# Altium project SFControl.PrjPcb
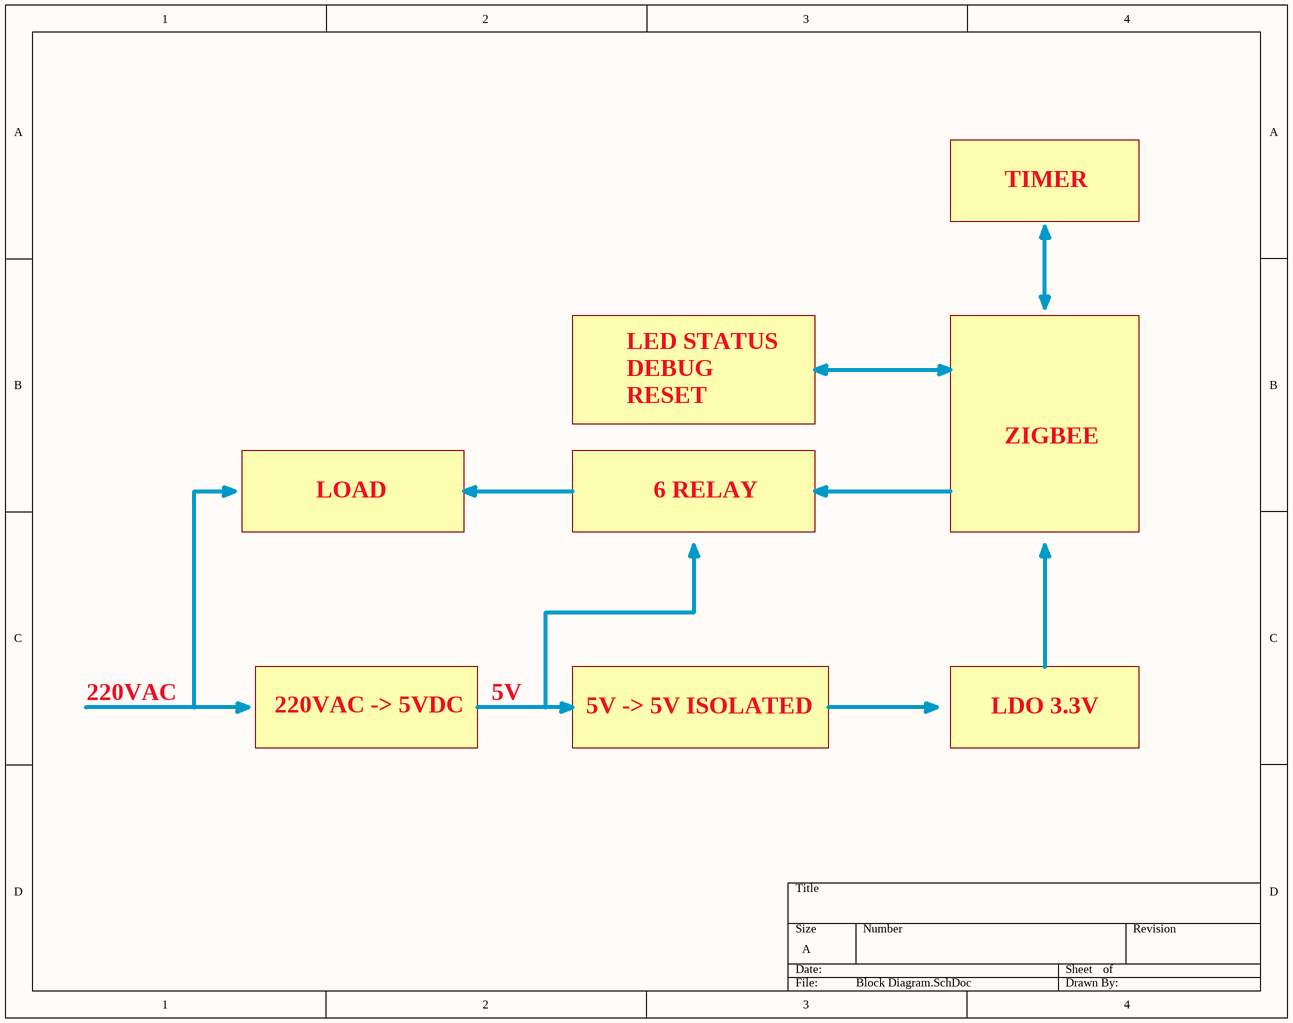
[diagram p0: Block Diagram.SchDoc]
4 sheets, 79 parts. Net scope: flat (ports and power ports of the same name join across sheets).
Board file: SFControl.PcbDoc
Sheets:
  Block Diagram.SchDoc
  Power.SchDoc
  Connectivity.SchDoc
  Control.SchDoc

## Sheet Block Diagram.SchDoc
size A; DocumentNumber: 1; SheetNumber: 1; SheetTotal: 4

### Notes on the sheet
- TIMER
- LED STATUS
- DEBUG
- RESET
- LOAD
- 6 RELAY
- ZIGBEE
- 220VAC
- 5V
- 220VAC -> 5VDC
- 5V -> 5V ISOLATED
- LDO 3.3V

## Sheet Power.SchDoc
size A; DocumentNumber: 2; SheetNumber: 2; SheetTotal: 4
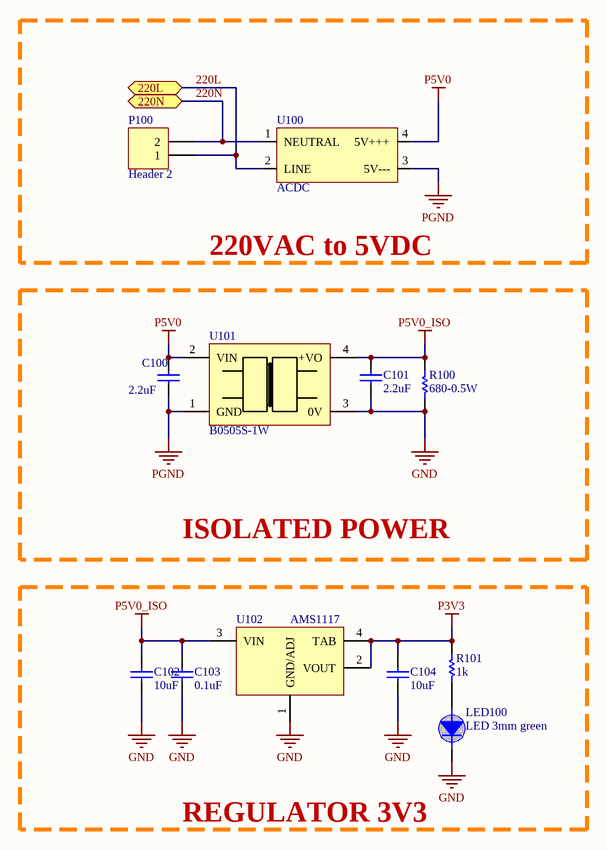
[diagram p1: Power.SchDoc]

### Parts
C100  2.2uF  [0805 cap]
C101  2.2uF  [0805 cap]
C102  10uF  [0805 cap]
C103  0.1uF  [0805 cap]
C104  10uF  [0805 cap]
LED100  LED 3mm green  [LED 3mm green]
P100  Header 2  [HED2T]
R100  680-0.5W  [0805 Resistor]
R101  1k  [0805 Resistor]
U100  ACDC  [ACDC]
U101  B0505S-1W  [B0505S-1W]
U102  AMS1117  [SOT223-3]

### Blocks framed on the sheet
220VAC to 5VDC: P100 U100
ISOLATED POWER: C100 C101 R100 U101
REGULATOR 3V3: C102-C104 LED100 R101 U102

### Ports
220L, 220N

### Nets
GND: C101.1 C102.1 C103.1 C104.1 LED100.2(Katot) R100.1 U101.3(0V) U102.1(GND/ADJ)
P3V3: C104.2 R101.2 U102.2(VOUT) U102.4(TAB)
P5V0: C100.2 U100.4(5V+++) U101.2(VIN)
P5V0_ISO: C101.2 C102.2 C103.2 R100.2 U101.4(+VO) U102.3(VIN)
PGND: C100.1 U100.3(5V---) U101.1(GND)
220L: P100.1 U100.2(LINE) ; port 220L
220N: P100.2 U100.1(NEUTRAL) ; port 220N
NetLED100_1: LED100.1(anot) R101.1

### Library data of the parts
C100-C104 = cap SMD
P100 = Header 2: Header, 2-Pin; LatestRevisionDate: 17-Jul-2002; LatestRevisionNote: Re-released for DXP Platform.; Publisher: Altium Limited
R100 R101 = Resistor

## Sheet Connectivity.SchDoc
size A; DocumentNumber: 3; SheetNumber: 3; SheetTotal: 4
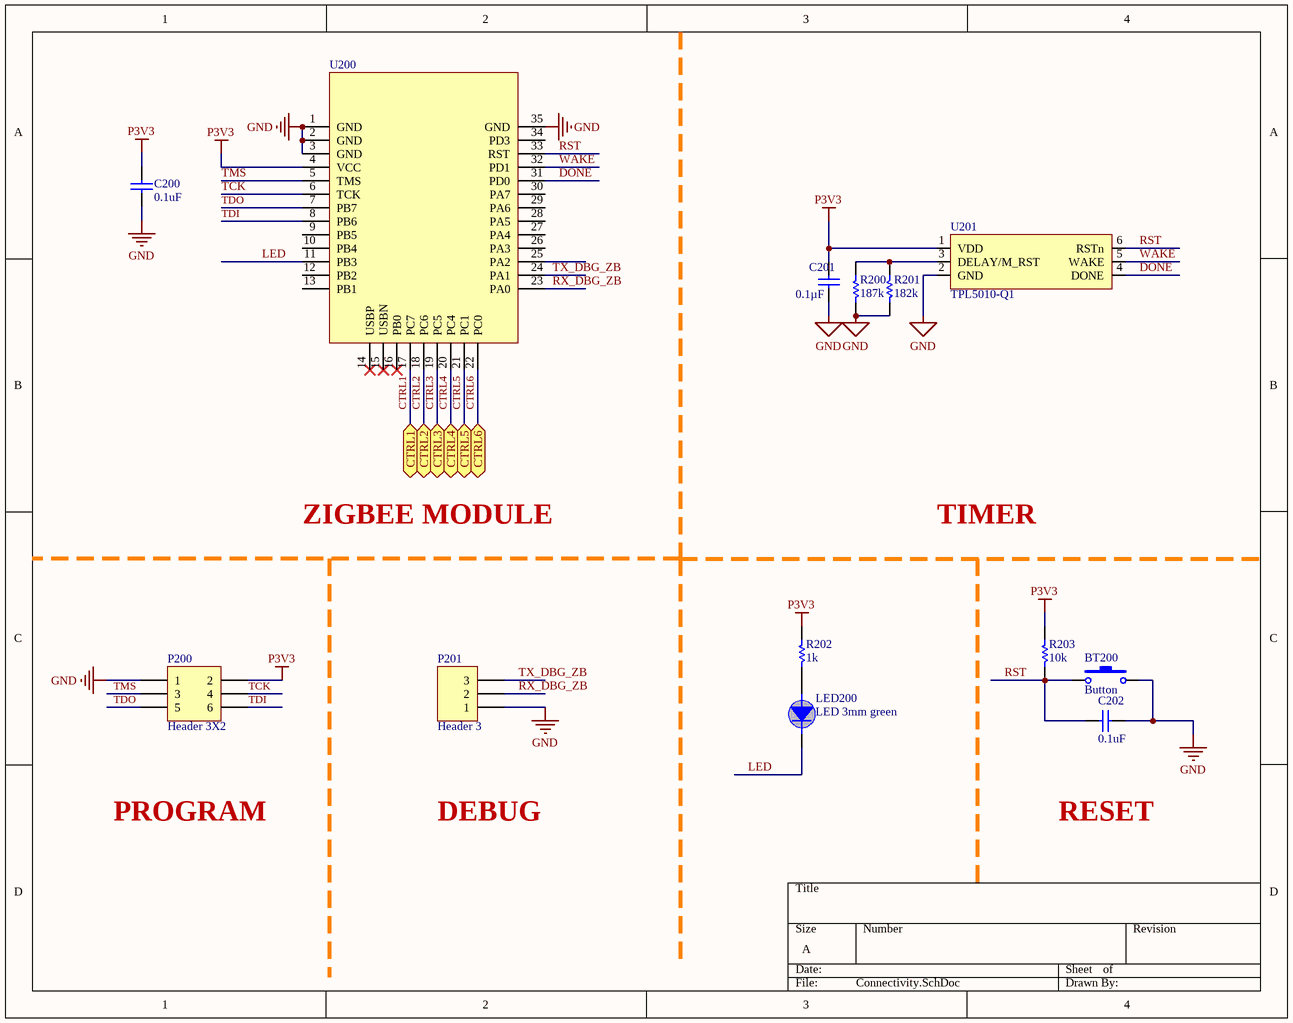
[diagram p2: Connectivity.SchDoc]

### Parts
BT200  Button  [SWSMD]
C200  0.1uF  [0805 cap]
C201  0.1µF  [0805 cap]
C202  0.1uF  [0805 cap]
LED200  LED 3mm green  [LED 3mm green]
P200  Header 3X2  [HDR2X3]
P201  Header 3  [HDR1X3]
R200  187k  [0805 Resistor]
R201  182k  [0805 Resistor]
R202  1k  [0805 Resistor]
R203  10k  [0805 Resistor]
U200  (no value)  [VZIGMOD2]
U201  TPL5010-Q1  [SOT23-6]

### Ports
CTRL1, CTRL2, CTRL3, CTRL4, CTRL5, CTRL6

### Nets
GND: BT200.2 C200.1 C201.1 C202.1 P200.1 P201.1 R200.1 R201.1 U200.1(GND) U200.2(GND) U200.3(GND) U200.35(GND) U201.2(GND)
P3V3: C200.2 C201.2 P200.2 R202.2 R203.2 U200.4(VCC) U201.1(VDD)
CTRL1: U200.17(PC7) ; port CTRL1
CTRL2: U200.18(PC6) ; port CTRL2
CTRL3: U200.19(PC5) ; port CTRL3
CTRL4: U200.20(PC4) ; port CTRL4
CTRL5: U200.21(PC1) ; port CTRL5
CTRL6: U200.22(PC0) ; port CTRL6
DONE: U200.31(PD0) U201.4(DONE)
LED: LED200.2(Katot) U200.11(PB3)
RST: BT200.1 C202.2 R203.1 U200.33(RST) U201.6(RSTn)
RX_DBG_ZB: P201.2 U200.23(PA0)
TCK: P200.4 U200.6(TCK)
TDI: P200.6 U200.8(PB6)
TDO: P200.5 U200.7(PB7)
TMS: P200.3 U200.5(TMS)
TX_DBG_ZB: P201.3 U200.24(PA1)
WAKE: U200.32(PD1) U201.5(WAKE)
NetLED200_1: LED200.1(anot) R202.1
NetR200_2: R200.2 R201.2 U201.3(DELAY/M_RST)

Not connected (* = marked no-connect by the designer): U200 9(PB5) 10(PB4) 12(PB2) 13(PB1) 14(USBP)* 15(USBN)* 16(PB0)* 25(PA2) 26(PA3) 27(PA4) 28(PA5) 29(PA6) 30(PA7) 34(PD3)

### Notes on the sheet
- ZIGBEE MODULE
- TIMER
- PROGRAM
- DEBUG
- RESET

### Library data of the parts
C200 = CAP0.1u0402: CAP CER 0.1UF 16V X7R 0402; Manufacturer: Samsung Electro-Mechanics; Manufacturer Part Number: CL05B104KO5NNNC; Tolerance: ±10%; Notification: Current market demand for these product types have resulted in fluctuating and extending lead times. Lead times may differ.; Module: Connectivity; Supplier 1: Digi-Key; Supplier Part Number 1: 1276-1001-6-ND; RoHS: RoHS Compliant; Category: Capacitors; Stock 1: 100000; Pricing 1: 1=0.1, 10=0.03, 100=0.0134, 500=0.00958, 1000=0.00753, 2500=0.00684, 5000=0.0063 (USD); Packaging: Digi-Reel®; Part Status: Active; Voltage - Rated: 16V; Temperature Coefficient: X7R; Operating Temperature: -55°C ~ 125°C; Features: -; Ratings: -; Applications: General Purpose; Mounting Type: Surface Mount, MLCC; Package / Case: 0402 (1005 Metric); Size / Dimension: 0.039" L x 0.020" W (1.00mm x 0.50mm); Height - Seated (Max): -; Thickness (Max): 0.022" (0.55mm); Lead Spacing: -; Lead Style: -; ComponentLink1URL: http://www.samsungsem.com/kr/support/product-search/mlcc/CL05B104KO5NNNC.jsp; ComponentLink1Description: http://www.samsungsem.com/kr/support/product-search/mlcc/CL05B104KO5NNNC.jsp
C201 = CAP0.1u0402: CAP CER 0.1UF 10V X7R 0402; Manufacturer: Taiyo Yuden; Manufacturer Part Number: LMK105B7104KVHF; Tolerance: ±10%; Supplier 1: Digi-Key; RoHS: RoHS Compliant; Category: Capacitors; Stock 1: 23930; Pricing 1: 1=0.1, 10=0.05, 100=0.0223, 500=0.01594, 1000=0.01252, 2500=0.01138, 5000=0.01047 (USD); Packaging: Cut Tape (CT); Part Status: Active; Capacitance: 0.1µF; Voltage - Rated: 10V; Temperature Coefficient: X7R; Operating Temperature: -55°C ~ 125°C; Features: -; Ratings: AEC-Q200; Applications: Automotive; Mounting Type: Surface Mount, MLCC; Package / Case: 0402 (1005 Metric); Size / Dimension: 0.039" L x 0.020" W (1.00mm x 0.50mm); Height - Seated (Max): -; Thickness (Max): 0.022" (0.55mm); Lead Spacing: -; Lead Style: -; ComponentLink1URL: http://www.yuden.co.jp/productdata/catalog/en/mlcc_all_hq_e.pdf; ComponentLink1Description: http://www.yuden.co.jp/productdata/catalog/en/mlcc_all_hq_e.pdf; Supplier Part Number 1: 587-3769-1-ND
C202 = cap SMD
P200 = Header 3X2: Header, 3-Pin, Dual row; LatestRevisionDate: 17-Jul-2002; LatestRevisionNote: Re-released for DXP Platform.; Publisher: Altium Limited
P201 = Header 3: Header, 3-Pin; LatestRevisionDate: 17-Jul-2002; LatestRevisionNote: Re-released for DXP Platform.; Publisher: Altium Limited
R200 = Resistor: RES SMD 187K OHM 1% 1/10W 0603; Manufacturer: Panasonic Electronic Components; Manufacturer Part Number: ERJ-3EKF1873V; Power (Watts): 0.1W, 1/10W; Temperature Coefficient: ±100ppm/°C; Supplier 1: Digi-Key; Supplier Part Number 1: P187KHCT-ND; RoHS: RoHS Compliant; Category: Resistors; Stock 1: 17711; Pricing 1: 1=0.1, 10=0.021, 100=0.0087, 1000=0.00389, 2500=0.00338 (USD); Packaging: Cut Tape (CT); Part Status: Active; Resistance (Ohms): 187k; Tolerance: ±1%; Composition: Thick Film; Features: Automotive AEC-Q200; Operating Temperature: -55°C ~ 155°C; Package / Case: 0603 (1608 Metric); Supplier Device Package: 0603; Size / Dimension: 0.063" L x 0.031" W (1.60mm x 0.80mm); Height - Seated (Max): 0.022" (0.55mm); Failure Rate: -; ComponentLink1URL: https://industrial.panasonic.com/cdbs/www-data/pdf/RDA0000/AOA0000C298.pdf; ComponentLink1Description: https://industrial.panasonic.com/cdbs/www-data/pdf/RDA0000/AOA0000C298.pdf
R201 = Resistor: RES SMD 182K OHM 1% 1/10W 0603; Manufacturer: Panasonic Electronic Components; Manufacturer Part Number: ERJ-3EKF1823V; Power (Watts): 0.1W, 1/10W; Temperature Coefficient: ±100ppm/°C; Supplier 1: Digi-Key; Supplier Part Number 1: P182KHCT-ND; RoHS: RoHS Compliant; Category: Resistors; Stock 1: 140068; Pricing 1: 1=0.1, 10=0.021, 100=0.0087, 1000=0.00389, 2500=0.00338 (USD); Packaging: Cut Tape (CT); Part Status: Active; Resistance (Ohms): 182k; Tolerance: ±1%; Composition: Thick Film; Features: Automotive AEC-Q200; Operating Temperature: -55°C ~ 155°C; Package / Case: 0603 (1608 Metric); Supplier Device Package: 0603; Size / Dimension: 0.063" L x 0.031" W (1.60mm x 0.80mm); Height - Seated (Max): 0.022" (0.55mm); Failure Rate: -; ComponentLink1URL: https://industrial.panasonic.com/cdbs/www-data/pdf/RDA0000/AOA0000C298.pdf; ComponentLink1Description: https://industrial.panasonic.com/cdbs/www-data/pdf/RDA0000/AOA0000C298.pdf
R202 R203 = Resistor
U200 = VZIGMOD2: VNPT ZIGBEE MODULE V1 - No-PA; Manufacturer: VNPT-Technology; Manufacturer Part Number: VZIGMOD1; Utilized IC / Part: CC2538; Catgory: RF/IF and RFID; Sensitivity: -99dBm; Data Rate: 250kbps; Frequency: 2.4GHz; Power - Output: 7dBm; Serial Interfaces: I²C, SPI, UART; Antenna Type: Integrated, PCB, External; Voltage - Supply: 1.85 V ~ 3.8 V; Module: Connectivity; Mounting Type: Surface Mount; Operating Temperature: -40°C ~ 85°C; Package / Case: 33-SMD Module
U201 = TPL5010: IC TIMER W/WATCHDOG 6SOT; Manufacturer: Texas Instruments; Manufacturer Part Number: TPL5010QDDCRQ1; Voltage - Supply: 1.8 V ~ 5 V; Current - Supply: 35nA; Supplier 1: Digi-Key; RoHS: RoHS Compliant; Category: Integrated Circuits (ICs); Stock 1: 2785; Pricing 1: 1=1.27, 10=1.136, 100=0.886, 500=0.73192, 1000=0.57783 (USD); Packaging: Cut Tape (CT); Part Status: Active; Type: Programmable Timer; Count: -; Frequency: -; Operating Temperature: -40°C ~ 125°C; Package / Case: SOT-23-6 Thin, TSOT-23-6; Supplier Device Package: TSOT-23-6; Mounting Type: Surface Mount; ComponentLink1URL: http://www.ti.com/lit/ds/symlink/tpl5010-q1.pdf; ComponentLink1Description: http://www.ti.com/lit/ds/symlink/tpl5010-q1.pdf; Supplier Part Number 1: 296-44963-1-ND

## Sheet Control.SchDoc
size A; DocumentNumber: 4; SheetNumber: 4; SheetTotal: 4
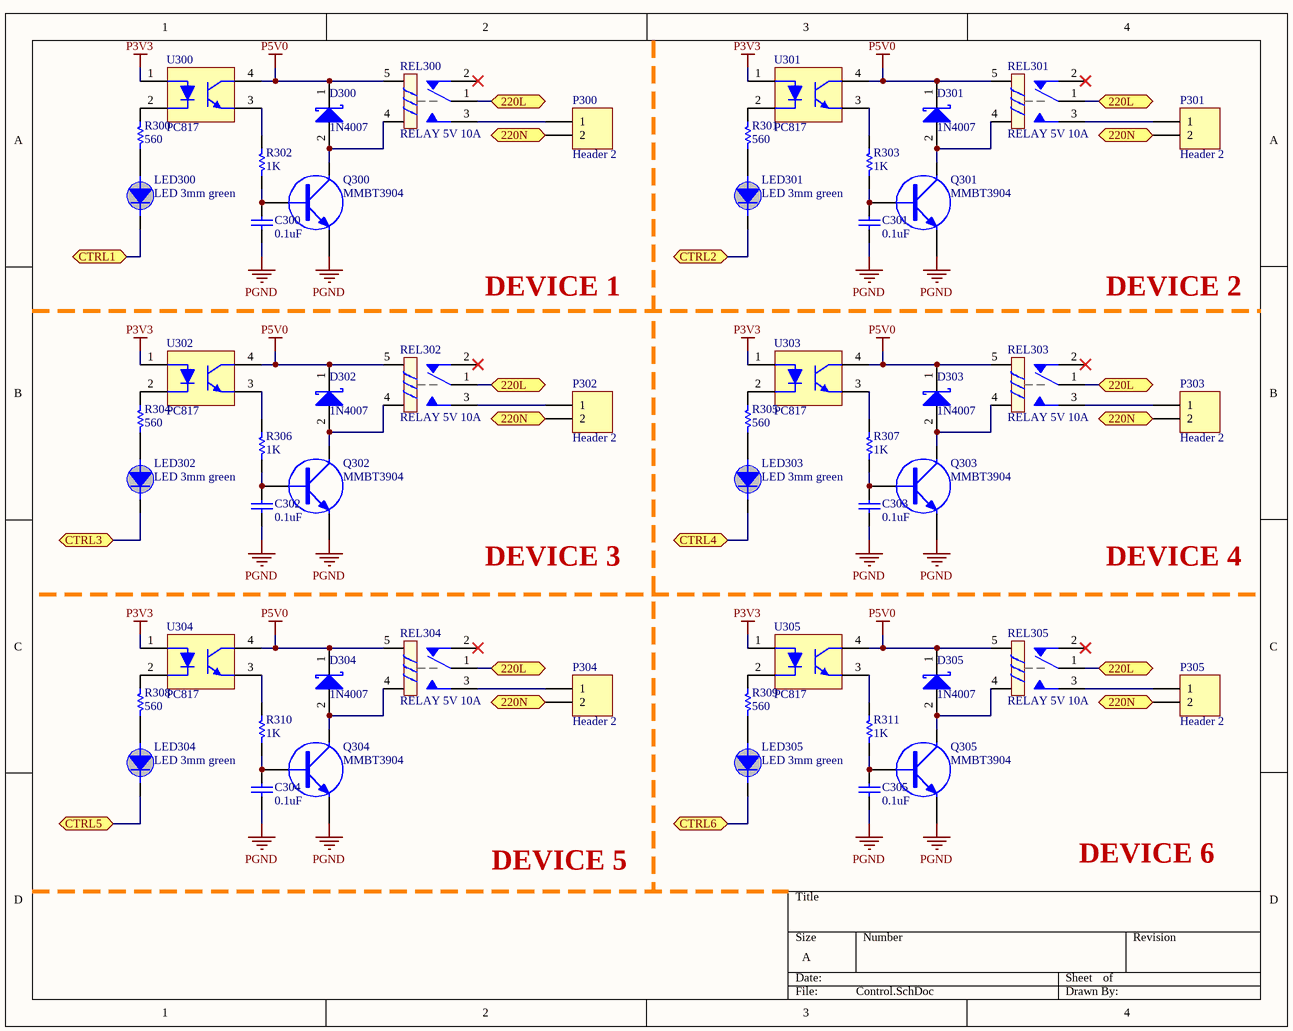
[diagram p3: Control.SchDoc]

### Parts
C300  0.1uF  [0805 cap]
C301  0.1uF  [0805 cap]
C302  0.1uF  [0805 cap]
C303  0.1uF  [0805 cap]
C304  0.1uF  [0805 cap]
C305  0.1uF  [0805 cap]
D300  1N4007  [SMA-diode]
D301  1N4007  [SMA-diode]
D302  1N4007  [SMA-diode]
D303  1N4007  [SMA-diode]
D304  1N4007  [SMA-diode]
D305  1N4007  [SMA-diode]
LED300  LED 3mm green  [LED 3mm green]
LED301  LED 3mm green  [LED 3mm green]
LED302  LED 3mm green  [LED 3mm green]
LED303  LED 3mm green  [LED 3mm green]
LED304  LED 3mm green  [LED 3mm green]
LED305  LED 3mm green  [LED 3mm green]
P300  Header 2  [HED2T]
P301  Header 2  [HED2T]
P302  Header 2  [HED2T]
P303  Header 2  [HED2T]
P304  Header 2  [HED2T]
P305  Header 2  [HED2T]
Q300  MMBT3904  [SOT23-3LN]
Q301  MMBT3904  [SOT23-3LN]
Q302  MMBT3904  [SOT23-3LN]
Q303  MMBT3904  [SOT23-3LN]
Q304  MMBT3904  [SOT23-3LN]
Q305  MMBT3904  [SOT23-3LN]
R300  560  [0805 Resistor]
R301  560  [0805 Resistor]
R302  1K  [0805 Resistor]
R303  1K  [0805 Resistor]
R304  560  [0805 Resistor]
R305  560  [0805 Resistor]
R306  1K  [0805 Resistor]
R307  1K  [0805 Resistor]
R308  560  [0805 Resistor]
R309  560  [0805 Resistor]
R310  1K  [0805 Resistor]
R311  1K  [0805 Resistor]
REL300  RELAY 5V 10A  [RELAY 5V-10A]
REL301  RELAY 5V 10A  [RELAY 5V-10A]
REL302  RELAY 5V 10A  [RELAY 5V-10A]
REL303  RELAY 5V 10A  [RELAY 5V-10A]
REL304  RELAY 5V 10A  [RELAY 5V-10A]
REL305  RELAY 5V 10A  [RELAY 5V-10A]
U300  PC817  [PC817 SMD]
U301  PC817  [PC817 SMD]
U302  PC817  [PC817 SMD]
U303  PC817  [PC817 SMD]
U304  PC817  [PC817 SMD]
U305  PC817  [PC817 SMD]

### Ports
220L, 220N, CTRL1, CTRL2, CTRL3, CTRL4, CTRL5, CTRL6

### Nets
P3V3: U300.1 U301.1 U302.1 U303.1 U304.1 U305.1
P5V0: D300.1(K) D301.1(K) D302.1(K) D303.1(K) D304.1(K) D305.1(K) REL300.5 REL301.5 REL302.5 REL303.5 REL304.5 REL305.5 U300.4 U301.4 U302.4 U303.4 U304.4 U305.4
PGND: C300.1 C301.1 C302.1 C303.1 C304.1 C305.1 Q300.3(E) Q301.3(E) Q302.3(E) Q303.3(E) Q304.3(E) Q305.3(E)
220L: REL300.1 REL301.1 REL302.1 REL303.1 REL304.1 REL305.1 ; port 220L
220N: P300.2 P301.2 P302.2 P303.2 P304.2 P305.2 ; port 220N
CTRL1: LED300.2(Katot) ; port CTRL1
CTRL2: LED301.2(Katot) ; port CTRL2
CTRL3: LED302.2(Katot) ; port CTRL3
CTRL4: LED303.2(Katot) ; port CTRL4
CTRL5: LED304.2(Katot) ; port CTRL5
CTRL6: LED305.2(Katot) ; port CTRL6
NetC300_2: C300.2 Q300.1(B) R302.2
NetC301_2: C301.2 Q301.1(B) R303.2
NetC302_2: C302.2 Q302.1(B) R306.2
NetC303_2: C303.2 Q303.1(B) R307.2
NetC304_2: C304.2 Q304.1(B) R310.2
NetC305_2: C305.2 Q305.1(B) R311.2
NetD300_2: D300.2(A) Q300.2(C) REL300.4
NetD301_2: D301.2(A) Q301.2(C) REL301.4
NetD302_2: D302.2(A) Q302.2(C) REL302.4
NetD303_2: D303.2(A) Q303.2(C) REL303.4
NetD304_2: D304.2(A) Q304.2(C) REL304.4
NetD305_2: D305.2(A) Q305.2(C) REL305.4
NetLED300_1: LED300.1(anot) R300.2
NetLED301_1: LED301.1(anot) R301.2
NetLED302_1: LED302.1(anot) R304.2
NetLED303_1: LED303.1(anot) R305.2
NetLED304_1: LED304.1(anot) R308.2
NetLED305_1: LED305.1(anot) R309.2
NetP300_1: P300.1 REL300.3
NetP301_1: P301.1 REL301.3
NetP302_1: P302.1 REL302.3
NetP303_1: P303.1 REL303.3
NetP304_1: P304.1 REL304.3
NetP305_1: P305.1 REL305.3
NetR300_1: R300.1 U300.2
NetR301_1: R301.1 U301.2
NetR302_1: R302.1 U300.3
NetR303_1: R303.1 U301.3
NetR304_1: R304.1 U302.2
NetR305_1: R305.1 U303.2
NetR306_1: R306.1 U302.3
NetR307_1: R307.1 U303.3
NetR308_1: R308.1 U304.2
NetR309_1: R309.1 U305.2
NetR310_1: R310.1 U304.3
NetR311_1: R311.1 U305.3

Not connected (* = marked no-connect by the designer): REL300 2*; REL301 2*; REL302 2*; REL303 2*; REL304 2*; REL305 2*

### Notes on the sheet
- DEVICE 1
- DEVICE 2
- DEVICE 3
- DEVICE 4
- DEVICE 5
- DEVICE 6

### Library data of the parts
C300-C305 = cap SMD
D300-D305 = Diode Schottky
P300-P305 = Header 2: Header, 2-Pin; LatestRevisionDate: 17-Jul-2002; LatestRevisionNote: Re-released for DXP Platform.; Publisher: Altium Limited
Q300-Q305 = MMBT3904: TRANS NPN 40V 0.2A SOT-23; Manufacturer: Fairchild/ON Semiconductor; Current - Collector (Ic) (Max): 200mA; Vce Saturation (Max) @ Ib, Ic: 300mV @ 5mA, 50mA; DC Current Gain (hFE) (Min) @ Ic, Vce: 100 @ 10mA, 1V; Power - Max: 350mW; Frequency - Transition: 300MHz; Supplier 1: Digi-Key; Manufacturer Part Number: MMBT3904; RoHS: RoHS Compliant; Category: Discrete Semiconductor Products; Stock 1: 366264; Pricing 1: 1=0.16, 10=0.149, 100=0.0812, 500=0.04998, 1000=0.03408 (USD); Packaging: Cut Tape (CT); Part Status: Active; Transistor Type: NPN; Voltage - Collector Emitter Breakdown (Max): 40V; Current - Collector Cutoff (Max): -; Operating Temperature: -55°C ~ 150°C (TJ); Mounting Type: Surface Mount; Package / Case: TO-236-3, SC-59, SOT-23-3; Supplier Device Package: SOT-23-3; ComponentLink1URL: https://www.fairchildsemi.com/datasheets/MM/MMBT3904.pdf; ComponentLink1Description: https://www.fairchildsemi.com/datasheets/MM/MMBT3904.pdf; Supplier Part Number 1: MMBT3904FSCT-ND
R300-R311 = Resistor

## Nets that join several sheets
GND: Power (8 pins), Connectivity (13 pins)
P3V3: Power (C104.2 R101.2 U102.2 U102.4), Connectivity (7 pins), Control (6 pins)
P5V0: Power (C100.2 U100.4 U101.2), Control (18 pins)
PGND: Power (C100.1 U100.3 U101.1), Control (12 pins)
220L: Power (P100.1 U100.2), Control (6 pins)
220N: Power (P100.2 U100.1), Control (6 pins)
CTRL1: Connectivity (U200.17), Control (LED300.2)
CTRL2: Connectivity (U200.18), Control (LED301.2)
CTRL3: Connectivity (U200.19), Control (LED302.2)
CTRL4: Connectivity (U200.20), Control (LED303.2)
CTRL5: Connectivity (U200.21), Control (LED304.2)
CTRL6: Connectivity (U200.22), Control (LED305.2)